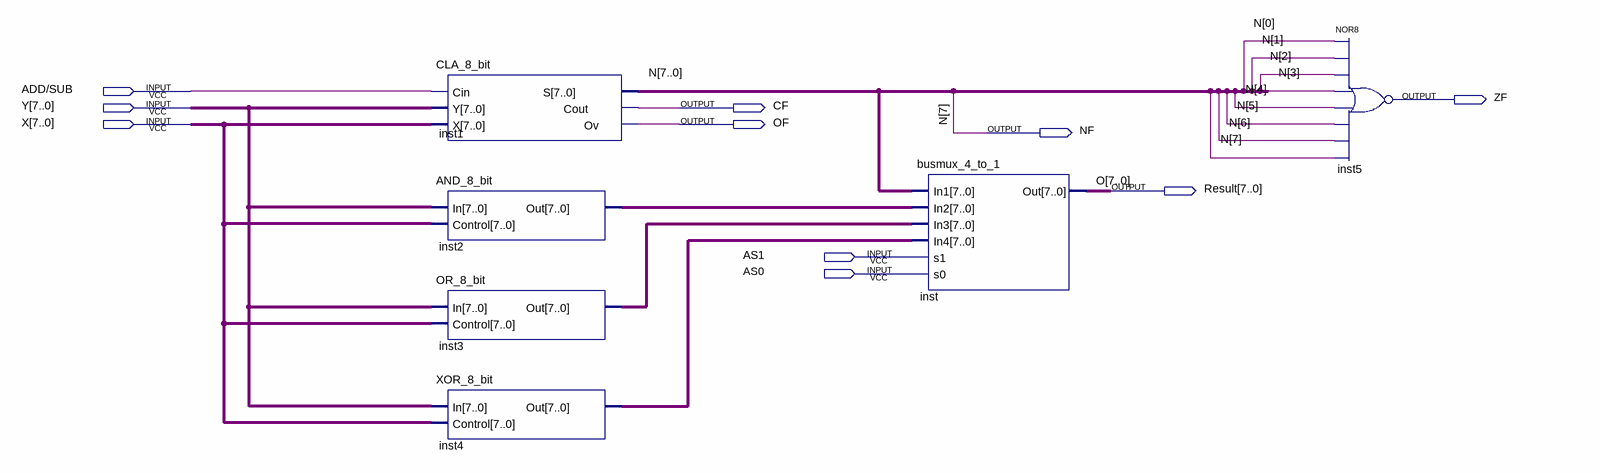
[diagram p0: schematic sheet]
// Quartus schematic ALU.bdf as structural Verilog: 6 symbols, 10 pins
module ALU (
  input  \ADD/SUB ,
  input  [7:0] Y,
  input  [7:0] X,
  input  AS1,
  input  AS0,
  output ZF,
  output CF,
  output OF,
  output NF,
  output [7:0] Result
);

  wire [6:0] N;
  wire [7:0] inst2_out, inst3_out, inst4_out;

  CLA_8_bit inst1 (.Cin(\ADD/SUB ), .Y(Y), .X(X), .S({NF, N}), .Cout(CF), .Ov(OF));
  AND_8_bit inst2 (.In(Y), .Control(X), .Out(inst2_out));
  OR_8_bit inst3 (.In(Y), .Control(X), .Out(inst3_out));
  XOR_8_bit inst4 (.In(Y), .Control(X), .Out(inst4_out));
  busmux_4_to_1 inst (
    .In1({NF, N}), .In2(inst2_out), .In3(inst3_out), .In4(inst4_out), .s1(AS1), .s0(AS0), .Out(Result));
  nor inst5 (ZF, N[0], N[1], N[2], N[3], N[4], N[5], N[6], NF);

  // Other names for the same wires on the sheet: N[7] = NF; O[7:0] = Result
endmodule
